# Altium schematic sheet Sheet_1_2021-03-18.schdoc
size 429 x 307 mm
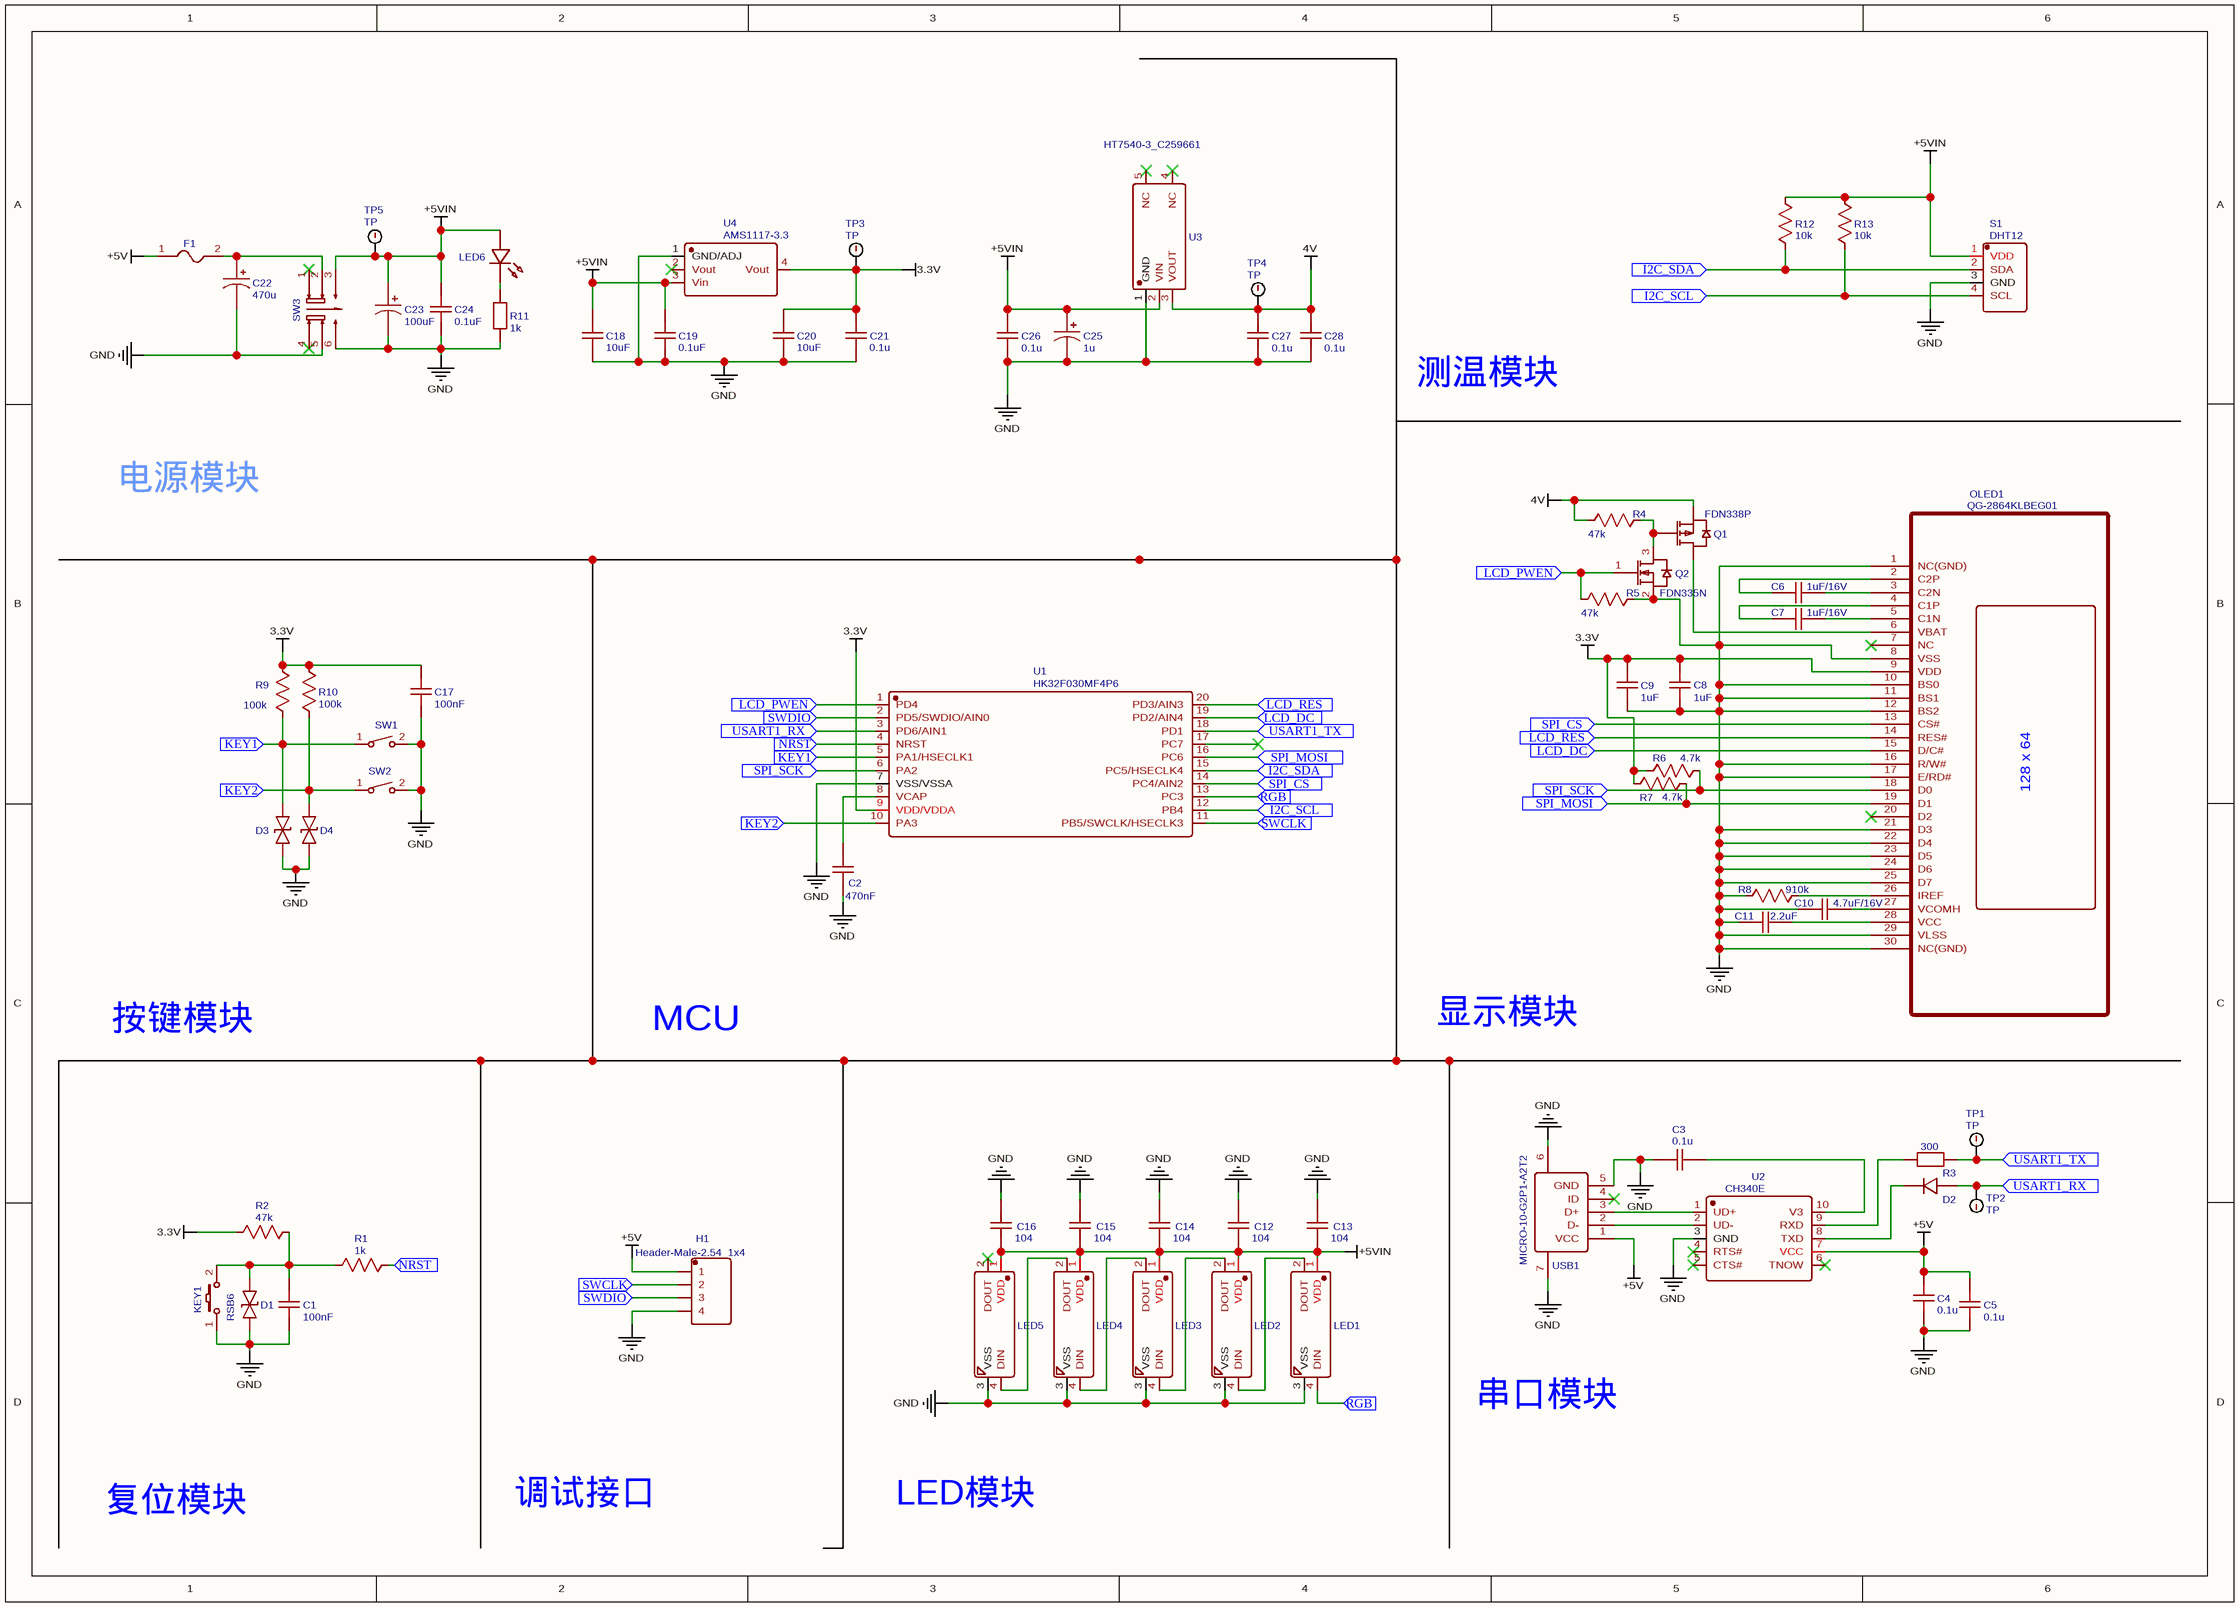
[diagram p0: Sheet_1_2021-03-18.schdoc]

## Parts
C1  100nF  [C0603]
C2  470nF  [C0603]
C3  0.1u  [C0603]
C4  0.1u  [C0603]
C5  0.1u  [C0603]
C6  1uF/16V  [C0603]
C7  1uF/16V  [C0603]
C8  1uF  [C0603]
C9  1uF  [C0603]
C10  4.7uF/16V  [C0603]
C11  2.2uF  [C0603]
C12  104  [C0603]
C13  104  [C0603]
C14  104  [C0603]
C15  104  [C0603]
C16  104  [C0603]
C17  100nF  [C0603]
C18  10uF  [C0603]
C19  0.1uF  [C0603]
C20  10uF  [C0603]
C21  0.1u  [C0603]
C22  470u  [CAP-D3.0-F1.5]
C23  100uF  [CAP-D3.0-F1.5]
C24  0.1uF  [C0603]
C25  1u  [CASE-A_3216]
C26  0.1u  [C0603]
C27  0.1u  [C0603]
C28  0.1u  [C0603]
D1  RSB6  [SOD-923_L0.8-W0.6-LS1.0-BI]
D2  1N4007W  [SOD-123_L2.8-W1.8-LS3.7-RD]  (value not drawn)
D3  ESD9B5VDA-2/TR  [SOD-923_L0.8-W0.6-LS1.0-BI]  (value not drawn)
D4  ESD9B5VDA-2/TR  [SOD-923_L0.8-W0.6-LS1.0-BI]  (value not drawn)
F1  BSMD0805-050-6V  [F0805]  (value not drawn)
H1  Header-Male-2.54_1x4  [HDR-TH_4P-P2.54-V]
KEY1  K2-3.6×6.1_SMD  [KEY-SMD_2P-L6.2-W3.6-LS8.0]  (value not drawn)
LED1  WS2812B  [LED-SMD_4P-L5.0-W5.0-TL]  (value not drawn)
LED2  WS2812B  [LED-SMD_4P-L5.0-W5.0-TL]  (value not drawn)
LED3  WS2812B  [LED-SMD_4P-L5.0-W5.0-TL]  (value not drawn)
LED4  WS2812B  [LED-SMD_4P-L5.0-W5.0-TL]  (value not drawn)
LED5  WS2812B  [LED-SMD_4P-L5.0-W5.0-TL]  (value not drawn)
LED6  LED-0603_R  [LED0603_RED]  (value not drawn)
OLED1  QG-2864KLBEG01  [OLED-SMD_QG-2864XXX]
Q1  FDN338P  [SOT-23-3_L2.9-W1.6-P1.90-LS2.8-BR]
Q2  FDN335N  [SOT-23-3_L3.0-W1.7-P0.95-LS2.9-BR]
R1  1k  [R0603]
R2  47k  [R0603]
R3  300  [R0603]
R4  47k  [R0603]
R5  47k  [R0603]
R6  4.7k  [R0603]
R7  4.7k  [R0603]
R8  910k  [R0603]
R9  100k  [R0603]
R10  100k  [R0603]
R11  1k  [R0603]
R12  10k  [R0603]
R13  10k  [R0603]
S1  DHT12  [SENSOR-TH_DHT12]
SW1  K2-1807SN-B4DW-06  [SW-SMD_L4.0-W3.0-LS4.8-EH]  (value not drawn)
SW2  K2-1807SN-B4DW-06  [SW-SMD_L4.0-W3.0-LS4.8-EH]  (value not drawn)
SW3  UK-G0701-ZS-Y  [SW-TH_UK-G0701-ZS-Y]  (value not drawn)
TP1  TP  [TP]
TP2  TP  [TP]
TP3  TP  [TP]
TP4  TP  [TP]
TP5  TP  [TP]
U1  HK32F030MF4P6  [TSSOP-20_L6.5-W4.4-P0.65-LS6.4-BL]
U2  CH340E  [MSOP-10_L3.0-W3.0-P0.50-LS5.0-BL]
U3  HT7540-3_C259661  [SOT-23-5_L3.0-W1.7-P0.95-LS2.8-BL]
U4  AMS1117-3.3  [SOT-223-3_L6.5-W3.4-P2.30-LS7.0-BR]
USB1  MICRO-10-G2P1-A2T2  [MICRO-USB-SMD_MICRO-10-GXPX-A2T2]

## Ports
I2C_SCL (in), I2C_SDA (in), KEY1 (in), KEY2 (in), LCD_DC (in), LCD_PWEN (in), LCD_RES (in), NRST (in), RGB (in), SPI_CS (in), SPI_MOSI (in), SPI_SCK (in), SWCLK (in), SWDIO (in), USART1_RX (in), USART1_TX (in)

## Nets
3.3V: C8.2 C9.2 C17.2 C20.2 C21.2 OLED1.9(VDD) R2.2 R6.1 R7.1 R9.2 R10.2 TP3.1 U1.9(VDD/VDDA) U4.4(Vout)
4V: C27.1 C28.1 Q1.2(S) R4.1 TP4.1 U3.3(VOUT)
+5V: C4.2 C5.2 F1.1 H1.1 U2.7(VCC) USB1.1(VCC)
+5VIN: C12.2 C13.2 C14.2 C15.2 C16.2 C18.2 C19.2 C23.1 C24.2 C25.1 C26.1 LED1.1(VDD) LED2.1(VDD) LED3.1(VDD) LED4.1(VDD) LED5.1(VDD) LED6.1 R12.2 R13.2 S1.1(VDD) SW3.3 TP5.1 U3.2(VIN) U4.3(Vin)
GND: C1.2 C2.1 C3.1 C4.1 C5.1 C8.1 C9.1 C10.1 C11.1 C12.1 C13.1 C14.1 C15.1 C16.1 C17.1 C18.1 C19.1 C20.1 C21.1 C22.2 C23.2 C24.1 C25.2 C26.2 C27.2 C28.2 D1.1 D3.1 D4.1 H1.4 KEY1.1 LED1.3(VSS) LED2.3(VSS) LED3.3(VSS) LED4.3(VSS) LED5.3(VSS) OLED1.1(NC(GND)) OLED1.8(VSS) OLED1.10(BS0) OLED1.11(BS1) OLED1.12(BS2) OLED1.16(R/W#) OLED1.17(E/RD#) OLED1.21(D3) OLED1.22(D4) OLED1.23(D5) OLED1.24(D6) OLED1.25(D7) OLED1.29(VLSS) OLED1.30(NC(GND)) Q2.2(S) R5.2 R8.1 R11.1 S1.3(GND) SW1.2 SW2.2 SW3.5 SW3.6 U1.7(VSS/VSSA) U2.3(GND) U3.1(GND) U4.1(GND/ADJ) USB1.5(GND) USB1.6 USB1.7
I2C_SCL: R13.1 S1.4(SCL) U1.12(PB4) ; port I2C_SCL
I2C_SDA: R12.1 S1.2(SDA) U1.15(PC5/HSECLK4) ; port I2C_SDA
KEY1: D3.2 R9.1 SW1.1 U1.5(PA1/HSECLK1) ; port KEY1
KEY2: D4.2 R10.1 SW2.1 U1.10(PA3) ; port KEY2
LCD_DC: OLED1.15(D/C#) U1.19(PD2/AIN4) ; port LCD_DC
LCD_PWEN: Q2.1(G) R5.1 U1.1(PD4) ; port LCD_PWEN
LCD_RES: OLED1.14(RES#) U1.20(PD3/AIN3) ; port LCD_RES
NRST: R1.2 U1.4(NRST) ; port NRST
RGB: LED1.4(DIN) U1.13(PC3) ; port RGB
SPI_CS: OLED1.13(CS#) U1.14(PC4/AIN2) ; port SPI_CS
SPI_MOSI: OLED1.19(D1) R7.2 U1.16(PC6) ; port SPI_MOSI
SPI_SCK: OLED1.18(D0) R6.2 U1.6(PA2) ; port SPI_SCK
SWCLK: H1.2 U1.11(PB5/SWCLK/HSECLK3) ; port SWCLK
SWDIO: H1.3 U1.2(PD5/SWDIO/AIN0) ; port SWDIO
USART1_RX: D2.2 TP2.1 U1.3(PD6/AIN1) ; port USART1_RX
USART1_TX: R3.2 TP1.1 U1.18(PD1) ; port USART1_TX
NetC1_1: C1.1 D1.2 KEY1.2 R1.1 R2.1
NetC2_2: C2.2 U1.8(VCAP)
NetC3_2: C3.2 U2.10(V3)
NetC6_1: C6.1 OLED1.2(C2P)
NetC6_2: C6.2 OLED1.3(C2N)
NetC7_1: C7.1 OLED1.4(C1P)
NetC7_2: C7.2 OLED1.5(C1N)
NetC10_2: C10.2 OLED1.27(VCOMH)
NetC11_2: C11.2 OLED1.28(VCC)
NetC22_1: C22.1 F1.2 SW3.2
NetD2_1: D2.1 U2.8(TXD)
NetLED1_2: LED1.2(DOUT) LED2.4(DIN)
NetLED2_2: LED2.2(DOUT) LED3.4(DIN)
NetLED3_2: LED3.2(DOUT) LED4.4(DIN)
NetLED4_2: LED4.2(DOUT) LED5.4(DIN)
NetLED6_2: LED6.2 R11.2
NetOLED1_6: OLED1.6(VBAT) Q1.3(D)
NetOLED1_26: OLED1.26(IREF) R8.2
NetQ1_1: Q1.1(G) Q2.3(D) R4.2
NetR3_1: R3.1 U2.9(RXD)
NetU2_1: U2.1(UD+) USB1.3(D+)
NetU2_2: U2.2(UD-) USB1.2(D-)

Not connected (* = marked no-connect by the designer): LED5 2(DOUT)*; OLED1 7(NC)* 20(D2)*; SW3 1* 4*; U1 17(PC7)*; U2 4(RTS#)* 5(CTS#)* 6(TNOW)*; U3 4(NC)* 5(NC)*; U4 2(Vout)*; USB1 4(ID)*

## Notes on the sheet
- 测温模块
- 电源模块
- 按键模块
- MCU
- 显示模块
- 串口模块
- 复位模块
- 调试接口
- LED模块
- (in symbol QG-2864KLBEG01) 128 x 64

## Library data of the parts
C1 C17 = 100nF: nameAlias: Value(F); Contributor: LCEDA_Lib; spicePre: C; spiceSymbolName: C_0603_US
C2 = 470nF: nameAlias: Value(F); Contributor: LCEDA_Lib; spicePre: C; spiceSymbolName: C_0603_US
C3-C5 C21 C26-C28 = 0.1u: nameAlias: Value(F); Contributor: LCEDA_Lib; spicePre: C; spiceSymbolName: C_0603_US
C6 C7 = 1uF/16V: nameAlias: Value(F); Contributor: LCEDA_Lib; spicePre: C; spiceSymbolName: C_0603_US
C8 C9 = 1uF: nameAlias: Value(F); Contributor: LCEDA_Lib; spicePre: C; spiceSymbolName: C_0603_US
C10 = 4.7uF/16V: nameAlias: Value(F); Contributor: LCEDA_Lib; spicePre: C; spiceSymbolName: C_0603_US
C11 = 2.2uF: nameAlias: Value(F); Contributor: LCEDA_Lib; spicePre: C; spiceSymbolName: C_0603_US
C12-C16 = 104: nameAlias: Value(F); Contributor: LCEDA_Lib; spicePre: C; spiceSymbolName: C_0603_US
C18 C20 = 10uF: nameAlias: Value(F); Contributor: LCEDA_Lib; spicePre: C; spiceSymbolName: C_0603_US
C19 C24 = 0.1uF: nameAlias: Value(F); Contributor: LCEDA_Lib; spicePre: C; spiceSymbolName: C_0603_US
C22 = 470u: nameAlias: Value(F); Contributor: LCEDA_Lib; spicePre: C; spiceSymbolName: C_Tan_SMD_A_US
C23 = 100uF: nameAlias: Value(F); Contributor: LCEDA_Lib; spicePre: C; spiceSymbolName: C_Tan_SMD_A_US
C25 = 1u: nameAlias: Value(F); Contributor: LCEDA_Lib; spicePre: C; spiceSymbolName: C_Tan_SMD_A_US
D1 = RSB6: BOM_Manufacturer: ROHM Semicon; BOM_Manufacturer Part: RSB6.8CMGJT2N; Contributor: LCSC; BOM_Supplier: LCSC; BOM_Supplier Part: C236127; spicePre: D; spiceSymbolName: RSB6.8CMGJT2N
D2 = 1N4007W: BOM_Manufacturer: BLUE ROCKET; Contributor: LCEDA_Lib; BOM_Supplier: LCSC; BOM_Supplier Part: C328592; BOM_Manufacturer Part: 1N4007W; spicePre: D; spiceSymbolName: 1N4007W
D3 D4 = ESD9B5VDA-2/TR: BOM_Manufacturer: WILLSEMI(Will Semicon); Contributor: LCSC; BOM_Supplier: LCSC; BOM_Supplier Part: C506171; BOM_Manufacturer Part: ESD9B5VDA-2/TR; spicePre: D; spiceSymbolName: ESD9B5VDA-2/TR
F1 = BSMD0805-050-6V: BOM_Manufacturer: BHFUSE; Contributor: LCSC; BOM_Supplier: LCSC; BOM_Supplier Part: C883108; BOM_Manufacturer Part: BSMD0805-050-6V; spicePre: F; spiceSymbolName: BSMD0805-050-6V
H1 = Header-Male-2.54_1x4: BOM_Manufacturer: Ckmtw; BOM_Manufacturer Part: 210S-1*4P L=11.6MMGold-plated black; Contributor: LCSC; BOM_Paste Type: expand; BOM_Assembly Type: manualWeld; BOM_Supplier: LCSC; BOM_Supplier Part: C124378; spicePre: H; spiceSymbolName: Header-Male-2.54_1x4
KEY1 = K2-3.6×6.1_SMD: BOM_Manufacturer Part: K2-1107ST-A4SW-06; Contributor: LCEDA_Lib; 制造商: 韩国韩荣; BOM_Supplier Part: C118141; BOM_Supplier: LCSC; spicePre: K; spiceSymbolName: K2-3.6×6.1_SMD
LED1-LED5 = WS2812B: BOM_Manufacturer: Worldsemi; Contributor: LCSC; BOM_Paste Type: expand; BOM_Assembly Type: smtWeld; BOM_Supplier: LCSC; BOM_Manufacturer Part: WS2812B; BOM_Supplier Part: C114585; spicePre: L; spiceSymbolName: WS2812B
LED6 = LED-0603_R: BOM_Manufacturer: EVERLIGHT(台湾亿光); BOM_Manufacturer Part: 19-217/R6C-AL1M2VY/3T; Contributor: LCEDA_01; BOM_Supplier Part: C72044; BOM_Supplier: LCSC; spicePre: L; spiceSymbolName: LED-0603_R
OLED1 = QG-2864KLBEG01: BOM_Manufacturer: Allvision; BOM_Supplier: LCSC; BOM_Manufacturer Part: QG-2864KLBEG01; BOM_Supplier Part: C91755; spicePre: O; spiceSymbolName: QG-2864KLBEG01
Q1 = FDN338P: BOM_Manufacturer: FAIRCHILD; BOM_Paste Type: expand; BOM_Assembly Type: smtWeld; BOM_Supplier: LCSC; BOM_Manufacturer Part: FDN338P; BOM_Supplier Part: C24855; spicePre: Q; spiceSymbolName: FDN338P
Q2 = FDN335N: BOM_Manufacturer: ON Semicon; Contributor: LCSC; BOM_Supplier: LCSC; BOM_Supplier Part: C241804; BOM_Manufacturer Part: FDN335N; spicePre: Q; spiceSymbolName: FDN335N
R1 R11 = 1k: nameAlias: Value(Ω); Contributor: LCEDA_Lib; spicePre: R
  R1: spiceSymbolName: R_0603_US
  R11: spiceSymbolName: R_0603_EU
R2 R4 R5 = 47k: nameAlias: Value(Ω); Contributor: LCEDA_Lib; spicePre: R; spiceSymbolName: R_0603_US
R3 = 300: nameAlias: Value(Ω); Contributor: LCEDA_Lib; spicePre: R; spiceSymbolName: R_0603_EU
R6 R7 = 4.7k: nameAlias: Value(Ω); Contributor: LCEDA_Lib; spicePre: R; spiceSymbolName: R_0603_US
R8 = 910k: nameAlias: Value(Ω); Contributor: LCEDA_Lib; spicePre: R; spiceSymbolName: R_0603_US
R9 R10 = 100k: nameAlias: Value(Ω); Contributor: LCEDA_Lib; spicePre: R; spiceSymbolName: R_0603_US
R12 R13 = 10k: nameAlias: Value(Ω); Contributor: LCEDA_Lib; spicePre: R; spiceSymbolName: R_0603_US
S1 = DHT12: BOM_Manufacturer: AOSONG; BOM_Supplier Part: C83989; BOM_Supplier: LCSC; BOM_Manufacturer Part: DHT12; spicePre: S; spiceSymbolName: DHT12
SW1 SW2 = K2-1807SN-B4DW-06: BOM_Manufacturer: 韩国韩荣; Contributor: LCSC; BOM_Supplier: LCSC; BOM_Supplier Part: C840350; BOM_Manufacturer Part: K2-1807SN-B4DW-06; spicePre: S; spiceSymbolName: K2-1807SN-B4DW-06
SW3 = UK-G0701-ZS-Y: BOM_Manufacturer: USAKRO(美韩); Contributor: LCSC; BOM_Supplier: LCSC; BOM_Supplier Part: C493256; BOM_Manufacturer Part: UK-G0701-ZS-Y; spicePre: S; spiceSymbolName: UK-G0701-ZS-Y
TP1-TP5 = TP: Contributor: Nail3513; BOM_Manufacturer Part: TP; spicePre: T; spiceSymbolName: TP
U1 = HK32F030MF4P6: BOM_Manufacturer: HK; Contributor: LCSC; BOM_Paste Type: expand; BOM_Assembly Type: smtWeld; BOM_Supplier: LCSC; BOM_Supplier Part: C707444; BOM_Manufacturer Part: HK32F030MF4P6; spicePre: U; spiceSymbolName: HK32F030MF4P6
U2 = CH340E: BOM_Manufacturer: WCH; BOM_Paste Type: recommend; BOM_Assembly Type: smtWeld; BOM_Supplier: LCSC; BOM_Manufacturer Part: CH340E; BOM_Supplier Part: C99652; spicePre: U; spiceSymbolName: CH340E
U3 = HT7540-3_C259661: BOM_Manufacturer: Holtek Semicon; Contributor: LCSC; BOM_Supplier: LCSC; BOM_Supplier Part: C259661; BOM_Manufacturer Part: HT7540-3; spicePre: U; spiceSymbolName: HT7540-3_C259661
U4 = AMS1117-3.3: BOM_Manufacturer: AMS; sourceId: dwIGgezVh; BOM_Paste Type: base; BOM_Assembly Type: smtWeld; timeStamp: 1476261164; BOM_Supplier: LCSC; BOM_Manufacturer Part: AMS1117-3.3; image: //image.lceda.cn/szlcsc/C6186.jpg; BOM_Supplier Part: C6186; spicePre: U; spiceSymbolName: AMS1117-3.3
USB1 = MICRO-10-G2P1-A2T2: BOM_Manufacturer: Yuandi; Contributor: LCSC; BOM_Supplier: LCSC; BOM_Supplier Part: C2682537; BOM_Manufacturer Part: MICRO-10-G2P1-A2T2; spicePre: U; spiceSymbolName: MICRO-10-G2P1-A2T2